# Altium schematic sheet usb_to_uart_swd_bridge.SchDoc: Bridge, USB to UART, SWD
size B; Organization: Altium Limited; Address1: L3, 12a Rodborough Rd; Address2: Frenchs Forest; Address3: NSW; Address4: Australia 2086; Revision: A; SheetNumber: 6; SheetTotal: 7
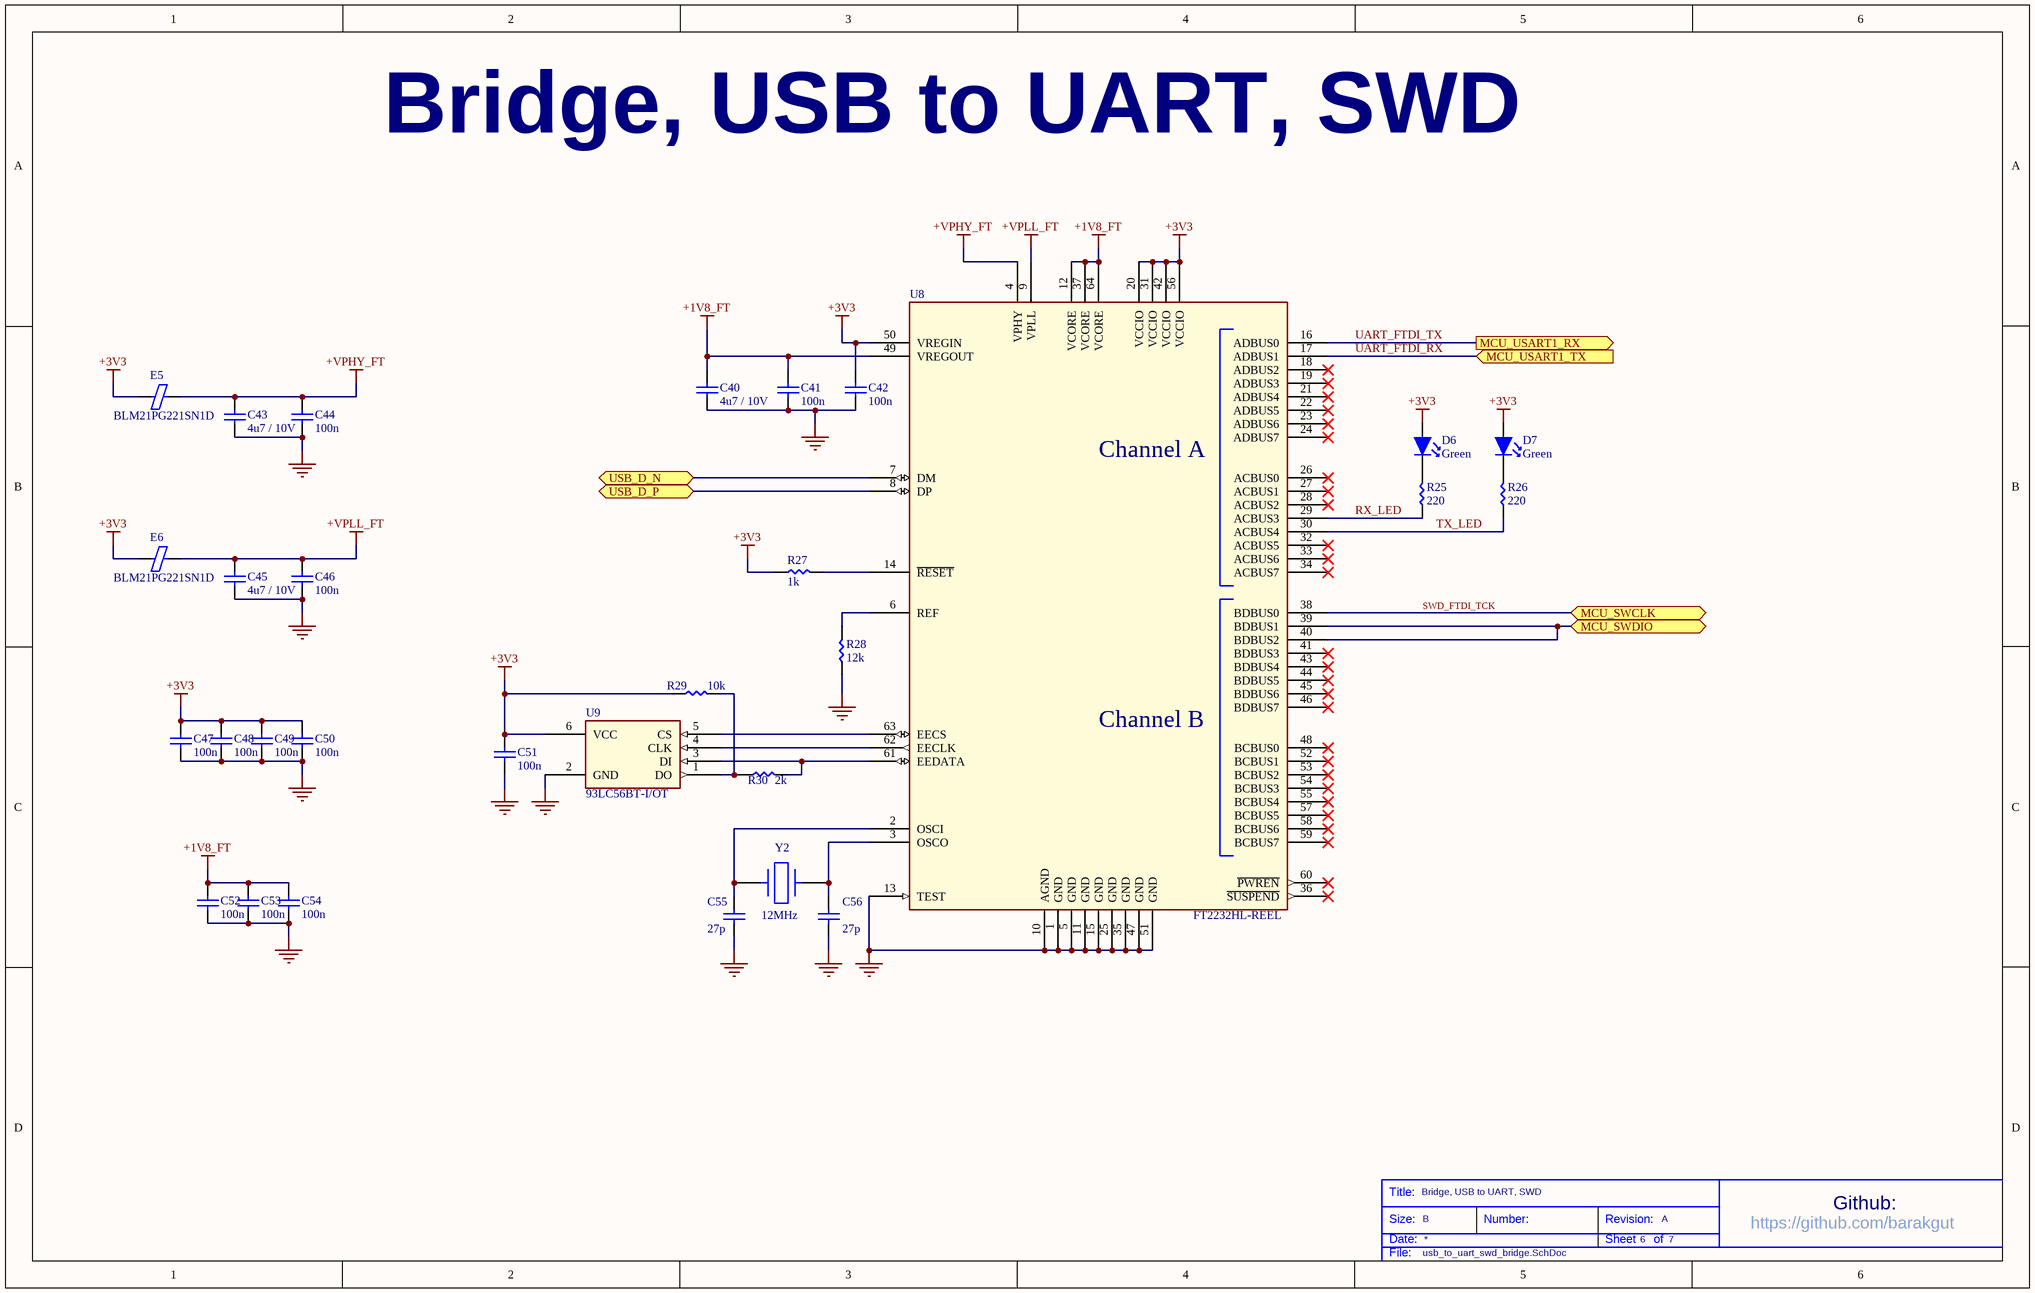
[diagram p0: usb_to_uart_swd_bridge.SchDoc]

## Parts
C40  4u7 / 10V  [C0805]
C41  100n  [C0402]
C42  100n  [C0402]
C43  4u7 / 10V  [C0805]
C44  100n  [C0402]
C45  4u7 / 10V  [C0805]
C46  100n  [C0402]
C47  100n  [C0402]
C48  100n  [C0402]
C49  100n  [C0402]
C50  100n  [C0402]
C51  100n  [C0402]
C52  100n  [C0402]
C53  100n  [C0402]
C54  100n  [C0402]
C55  27p  [C0402]
C56  27p  [C0402]
D6  Green  [150141VS73100_LED]
D7  Green  [150141VS73100_LED]
E5  BLM21PG221SN1D  [R0805]
E6  BLM21PG221SN1D  [R0805]
R25  220  [R0805]
R26  220  [R0805]
R27  1k  [R0805]
R28  12k  [R0805]
R29  10k  [R0805]
R30  2k  [R0805]
U8  FT2232HL-REEL  [LQFP64]
U9  93LC56BT-I/OT  [SOT-23-6]
Y2  12MHz  [ABLS7M2-12.000MHZ-D-2Y-T]

## Ports
MCU_SWCLK (bidir), MCU_SWDIO (bidir), MCU_USART1_RX (out), MCU_USART1_TX (in), USB_D_N (bidir), USB_D_P (bidir)

## Nets
+1V8_FT: C40.2 C41.2 C52.2 C53.2 C54.2 U8.12(VCORE) U8.37(VCORE) U8.49(VREGOUT) U8.64(VCORE)
+3V3: C42.2 C47.2 C48.2 C49.2 C50.2 C51.2 D6.2(A) D7.2(A) E5.1 E6.1 R27.1 R29.1 U8.20(VCCIO) U8.31(VCCIO) U8.42(VCCIO) U8.50(VREGIN) U8.56(VCCIO) U9.6(VCC)
+VPHY_FT: C43.2 C44.2 E5.2 U8.4(VPHY)
+VPLL_FT: C45.2 C46.2 E6.2 U8.9(VPLL)
GND: C40.1 C41.1 C42.1 C43.1 C44.1 C45.1 C46.1 C47.1 C48.1 C49.1 C50.1 C51.1 C52.1 C53.1 C54.1 C55.1 C56.1 R28.1 U8.1(GND) U8.5(GND) U8.10(AGND) U8.11(GND) U8.13(TEST) U8.15(GND) U8.25(GND) U8.35(GND) U8.47(GND) U8.51(GND) U9.2(GND)
MCU_SWDIO: U8.39(BDBUS1) U8.40(BDBUS2) ; port MCU_SWDIO
RX_LED: R25.1 U8.29(ACBUS3)
SWD_FTDI_TCK: U8.38(BDBUS0) ; port MCU_SWCLK
TX_LED: R26.1 U8.30(ACBUS4)
UART_FTDI_RX: U8.17(ADBUS1) ; port MCU_USART1_TX
UART_FTDI_TX: U8.16(ADBUS0) ; port MCU_USART1_RX
USB_D_N: U8.7(DM) ; port USB_D_N
USB_D_P: U8.8(DP) ; port USB_D_P
NetC55_2: C55.2 U8.2(OSCI) Y2.2
NetC56_2: C56.2 U8.3(OSCO) Y2.1
NetD6_1: D6.1(K) R25.2
NetD7_1: D7.1(K) R26.2
NetR27_2: R27.2 U8.14(~{RESET})
NetR28_2: R28.2 U8.6(REF)
NetR29_2: R29.2 R30.1 U9.1(DO)
NetR30_2: R30.2 U8.61(EEDATA) U9.3(DI)
NetU8_62: U8.62(EECLK) U9.4(CLK)
NetU8_63: U8.63(EECS) U9.5(CS)

Not connected (* = marked no-connect by the designer): U8 18(ADBUS2)* 19(ADBUS3)* 21(ADBUS4)* 22(ADBUS5)* 23(ADBUS6)* 24(ADBUS7)* 26(ACBUS0)* 27(ACBUS1)* 28(ACBUS2)* 32(ACBUS5)* 33(ACBUS6)* 34(ACBUS7)* 36(~{SUSPEND})* 41(BDBUS3)* 43(BDBUS4)* 44(BDBUS5)* 45(BDBUS6)* 46(BDBUS7)* 48(BCBUS0)* 52(BCBUS1)* 53(BCBUS2)* 54(BCBUS3)* 55(BCBUS4)* 57(BCBUS5)* 58(BCBUS6)* 59(BCBUS7)* 60(~{PWREN})*

## Notes on the sheet
- Bridge, USB to UART, SWD
- Title:
- Size:
- Date:
- B
- Number:
- Revision:
- Sheet
- of
- https://github.com/barakgut
- Github:
- File:
- (in symbol FT2232HL-REEL) Channel A; Channel B

## Library data of the parts
C40 C43 C45 = C2012X7R1A475K085AC: 4.7µF ±10% 10V X7R Ceramic Capacitor -55°C ~ 125°C Surface Mount, MLCC 0805 (2012 Metric) 0.079" L x 0.049" W (2.00mm x 1.25mm); Manufacturer: TDK; Product Training Modules: C Series General Applications SEAT, CCV, and TVCL Design Tools Guide to Replacing an Electrolytic Capacitor with an MLCC; EDA / CAD Models: Download from Accelerated Designs; Online Catalog: C Series, General Purpose; Other Names: 445-14527-6; Supplier 1: Digi-Key; Supplier Part Number 1: 445-14527-1-ND; Stock 1: 1; Pricing 1: 1=0.28, 10=0.19, 100=0.1075, 500=0.0759, 1000=0.0664 (USD); RoHS Information: RoHS Certificate-MLCC; Standard Package: 1; Category: Capacitors; Family: Ceramic Capacitors; Series: C; Packaging: Digi-Reel®; Capacitance: 4.7µF; Tolerance: ±10%; Voltage - Rated: 10V; Temperature Coefficient: X7R; Mounting Type: Surface Mount, MLCC; Operating Temperature: -55°C ~ 125°C; Applications: General Purpose; Package / Case: 0805 (2012 Metric); Size / Dimension: 0.079" L x 0.049" W (2.00mm x 1.25mm); Thickness (Max): 0.039" (1.00mm); Manufacturer Part Number: C2012X7R1A475K085AC
C41 C42 C44 C46-C54 = CGA2B3X7R1E104K050BB: TDK         CGA2B3X7R1E104K050BB             SMD Multilayer Ceramic Capacitor, 0402 [1005 Metric], 0.1 F, 25 V,  10%, X7R, CGA Series; PCN Part Number: MLCC Part Number Change 30/Nov/2012; Capacitance: 0.1µF; Product Training Modules: CGA Series for Automotive Applications SEAT, CCV, and TVCL Design Tools Guide to Replacing an Electrolytic Capacitor with an MLCC; Featured Product: CGA Series MLCC Capacitors; Voltage - Rated: 25V; Online Catalog: CGA Series, Automotive General, Mid and High Voltage; Other Names: 445-6902-6; Supplier 1: Digi-Key; Supplier Part Number 1: 445-6902-1-ND; Manufacturer: TDK; Stock 1: 100000; Pricing 1: 1=0.16, 10=0.115, 100=0.054, 500=0.0379, 1000=0.0314, 2500=0.0292, 5000=0.0267 (USD); Package / Case: 0402 (1005 Metric); Packaging: Digi-Reel®; RoHS Information: RoHS Certificate-MLCC; Standard Package: 1; Category: Capacitors; Family: Ceramic Capacitors; Series: CGA; Tolerance: ±10%; Temperature Coefficient: X7R; Mounting Type: Surface Mount, MLCC; Operating Temperature: -55°C ~ 125°C; Applications: Automotive; Ratings: AEC-Q200; Size / Dimension: 0.039" L x 0.020" W (1.00mm x 0.50mm); Height - Seated (Max): -; Thickness (Max): 0.022" (0.55mm); Lead Spacing: -; Features: -; Lead Style: -; ComponentLink1URL: http://www.farnell.com/datasheets/1735392.pdf; ComponentLink1Description: http://www.farnell.com/datasheets/1735392.pdf; ComponentLink2URL: http://www.mouser.com/ds/2/400/lcc_automotive_general_en-843974.pdf; ComponentLink2Description: http://www.mouser.com/ds/2/400/lcc_automotive_general_en-843974.pdf; Manufacturer Part Number: CGA2B3X7R1E104K050BB
C55 C56 = GJM1555C1H270FB01D: Manufacturer: Murata; Supplier 1: Digi-Key; Supplier Part Number 1: 490-16380-1-ND; Stock 1: 14501; Pricing 1: 1=0.23, 10=0.155, 100=0.0784, 500=0.0536, 1000=0.0474, 2500=0.0454, 5000=0.0413 (USD); Manufacturer Part Number: GJM1555C1H270FB01D; ComponentLink1URL: http://datasheet.octopart.com/GJM1555C1H270FB01D-Murata-datasheet-8819587.pdf; ComponentLink1Description: http://datasheet.octopart.com/GJM1555C1H270FB01D-Murata-datasheet-8819587.pdf; ComponentLink2URL: http://datasheet.octopart.com/GJM1555C1H270FB01D-Murata-datasheet-10025737.pdf; ComponentLink2Description: http://datasheet.octopart.com/GJM1555C1H270FB01D-Murata-datasheet-10025737.pdf; ComponentLink3URL: http://datasheet.octopart.com/GJM1555C1H270FB01D-Murata-datasheet-11978611.pdf; ComponentLink3Description: http://datasheet.octopart.com/GJM1555C1H270FB01D-Murata-datasheet-11978611.pdf; ComponentLink4URL: http://datasheet.octopart.com/GJM1555C1H270FB01D-Murata-datasheet-12510076.pdf; ComponentLink4Description: http://datasheet.octopart.com/GJM1555C1H270FB01D-Murata-datasheet-12510076.pdf; ComponentLink5URL: http://datasheet.octopart.com/GJM1555C1H270FB01D-Murata-datasheet-12515295.pdf; ComponentLink5Description: http://datasheet.octopart.com/GJM1555C1H270FB01D-Murata-datasheet-12515295.pdf
D6 D7 = 150141VS73100: WURTH ELEKTRONIK   150141VS73100   LED, GREEN, 90MCD, 570NM; Manufacturer: Wurth Electronics; Dynamic Catalog: 3.5mm x 2.8mm Round with Flat Top LEDs; 3D Model: SMTW_3528.igs / SMTW_3528.stp / SMTW_3528.wrl; Wavelength - Peak: 572nm; Voltage - Forward (Vf) (Typ): 2V; Current - Test: 20mA; Viewing Angle: 120°; Lens Type: Clear; Lens Style/Size: Round with Flat Top, 2.4mm; Other Names: 732-5002-1; Supplier 1: Digi-Key; Supplier Part Number 1: 732-5002-1-ND; Stock 1: 7722; Pricing 1: 1=0.17, 100=0.149, 500=0.113 (USD); Standard Package: 1; Category: Optoelectronics; Family: LED Indication - Discrete; Series: WL-SMTW; Packaging: Cut Tape (CT); Color: Green; Wavelength - Dominant: 570nm; Millicandela Rating: 90mcd; Package / Case: 2-PLCC; Size / Dimension: 3.20mm L x 2.80mm W; Height: 2.10mm; Mounting Type: Surface Mount; Online Catalog: 3.5mm x 2.8mm Round with Flat Top LEDs; Manufacturer Part Number: 150141VS73100
E5 E6 = BLM21PG221SN1D: FERRITE CHIP 220 OHM 0805; Manufacturer: Murata; Product Training Modules: Ferrite Beads and Arrays; Catalog Drawings: BLM21 Series Side BLM21 Series Top; EDA / CAD Models: Download from Accelerated Designs; Filter Type: Power Line; Number of Lines: 1; Impedance @ Frequency: 220 Ohm @ 100MHz; Current Rating (Max): 2A; DC Resistance (DCR) (Max): 45 mOhm; Online Catalog: EMIFIL® BLM21P Series; Other Names: 490-1054-6; Supplier 1: Digi-Key; Supplier Part Number 1: 490-1054-1-ND; Stock 1: 1796179; Pricing 1: 1=0.1, 10=0.081, 25=0.0732, 50=0.0538, 100=0.0464, 250=0.0366, 500=0.0309, 1000=0.0261 (USD); Standard Package: 1; Category: Filters; Family: Ferrite Beads and Chips; Series: BLM21P; Packaging: Digi-Reel®; Ratings: -; Operating Temperature: -55°C ~ 125°C; Package / Case: 0805 (2012 Metric); Mounting Type: Surface Mount; Height (Max): 0.041" (1.05mm); Size / Dimension: 0.079" L x 0.049" W (2.00mm x 1.25mm); Manufacturer Part Number: BLM21PG221SN1D
R25 R26 = AC0805FR-07220RL: Thick Film Resistors - SMD 1/8W 220ohm 1%; Manufacturer: Yageo; Case Height: 0.5 mm; Case Length: 2 mm; Case Width: 1.25 mm; Power Rating: 125 mW (1/8 W); Resistance: 220 Ohms; Temperature Coefficient: 100 PPM / C; Voltage Rating: 150 V; Supplier 1: Digi-Key; Supplier Part Number 1: YAG3711CT-ND; Stock 1: 11948; Pricing 1: 1=0.1, 10=0.055, 100=0.0225, 1000=0.0101, 2500=0.0088 (USD); Brand: Yageo; Case Code - in: 0805; Case Code - mm: 2012; Dimensions: 1.25 mm W x 2 mm L x 0.5 mm H; Product Category: Thick Film Resistors - SMD; Operating Temperature Range: - 55 C to + 155 C; Package / Case: 0805 (2012 metric); Packaging: Reel; Product: Thick Film Resistors SMD; Termination Style: SMD/SMT; RoHS: Details; Tolerance: 1 %; Series: AC; Type: Chip Resistor Surface Mount; Manufacturer Part Number: AC0805FR-07220RL
R27 = RC0805FR-071KL: RES SMD 1K OHM 1% 1/8W 0805; Manufacturer: Yageo; Resistance: 1 kOhms; Power Rating: 125 mW (1/8 W); Voltage Rating: 150 V; Temperature Coefficient: 100 PPM / C; Supplier 1: Digi-Key; Supplier Part Number 1: 311-1.00KCRCT-ND; Stock 1: 1262363; Pricing 1: 1=0.1, 10=0.046, 100=0.0186, 1000=0.0084, 2500=0.0073 (USD); Termination Style: SMD/SMT; Product: Thick Film Resistors General Purpose; Tolerance: 1 %; Case Code - in: 0805; Case Code - mm: 2012; Series: RC; Operating Temperature Range: - 55 C to + 155 C; Packaging: Reel; Manufacturer Part Number: RC0805FR-071KL
R28 = AC0805FR-0712KL: Res Thick Film 0805 12K Ohm 1% 0.125W(1/8W) ±100ppm/C Sulfur Resistant Molded SMD Automotive Paper T/R; Manufacturer: Yageo; Resistance: 12kohm; Temperature Coefficient: ±100; Product Length (mm): 2mm; Product Depth (mm): 1.25mm; Product Height (mm): 0.5mm; Supplier 1: Digi-Key; Supplier Part Number 1: YAG3692CT-ND; Stock 1: 218; Pricing 1: 1=0.1, 10=0.055, 100=0.0225, 1000=0.0101, 2500=0.0088 (USD); Type: Thick Film; Power Rating(s): 1/8W; Tolerance (+ or -): 1%; Package / Case: 0805; Packaging: Tape and Reel; Operating Temp Range: -55C to 155C; Case Style: Molded; Military Standard: Not Required; Failure Rate: Not Required; Construction: Rectangular; Termination Style: Not Required; Manufacturer Part Number: AC0805FR-0712KL
R29 = RC0805FR-0710KL: RES SMD 10K OHM 1% 1/8W 0805; Manufacturer: Yageo; Resistance: 10 kOhms; Power Rating: 125 mW (1/8 W); Voltage Rating: 150 V; Temperature Coefficient: 100 PPM / C; Supplier 1: Digi-Key; Supplier Part Number 1: 311-10.0KCRCT-ND; Stock 1: 31531286; Pricing 1: 1=0.1, 10=0.046, 100=0.0186, 1000=0.0084, 2500=0.0073 (USD); Termination Style: SMD/SMT; Product: Thick Film Resistors General Purpose; Tolerance: 1 %; Case Code - in: 0805; Case Code - mm: 2012; Series: RC; Operating Temperature Range: - 55 C to + 155 C; Packaging: Reel; Manufacturer Part Number: RC0805FR-0710KL
R30 = RC0805FR-072KL: RES SMD 2K OHM 1% 1/8W 0805; Manufacturer: Yageo; Resistance: 2 kOhms; Power Rating: 125 mW (1/8 W); Voltage Rating: 150 V; Temperature Coefficient: 100 PPM / C; Supplier 1: Digi-Key; Supplier Part Number 1: 311-2.00KCRCT-ND; Stock 1: 993055; Pricing 1: 1=0.1, 10=0.046, 100=0.0186, 1000=0.0084, 2500=0.0073 (USD); Termination Style: SMD/SMT; Product: Thick Film Resistors General Purpose; Tolerance: 1 %; Case Code - in: 0805; Case Code - mm: 2012; Series: RC; Operating Temperature Range: - 55 C to + 155 C; Packaging: Reel; Manufacturer Part Number: RC0805FR-072KL
U8 = FT2232HL-REEL: IC USB HS DUAL UART/FIFO 64-LQFP; Manufacturer: FTDI; Number of Channels: 2; Interface Circuit Standard 1: RS-232/RS-422/RS-485; Transmitter and Receiver FIFO Counter: No; Data Rate: 480Mbps; Operating Supply Voltage (Typ): 1.8/3.3V; Operating Supply Voltage (Max): 3.63V; Operating Supply Voltage (Min): 1.62V; Supply Current: 70(Typ)mA; Supplier 1: Digi-Key; Supplier Part Number 1: 768-1024-1-ND; Stock 1: 30383; Pricing 1: 1=6.71, 10=6.2, 100=5.4, 250=4.56, 500=4.06 (USD); Package Type: LQFP; Packaging: Tape and Reel; Mounting: Surface Mount; Pin Count: 64; Operating Temperature (Min): -40C; Operating Temperature (Max): 85C; Operating Temperature Classification: Industrial; Manufacturer Part Number: FT2232HL-REEL
U9 = 93LC56BT-I/OT: EEPROM 128x16; Manufacturer: Microchip; Access Time (Max): 250 ns; Data Retention: 200; Density: 2048 Bit; Frequency: 2 MHz; Interface Type: Serial (Microwire); Operating Supply Voltage (Max): 5.5 V; Operating Supply Voltage (Min): 2.5 V; Operating Supply Voltage (Typ): 3.3/5 V; Programmable: Yes; Rad Hardened: No; Supply Current: 2 mA; Supplier 1: Digi-Key; Supplier Part Number 1: 93LC56BT-I/OTCT-ND; Stock 1: 24330; Pricing 1: 1=0.23, 25=0.2164, 100=0.2119 (USD); Mounting: Surface Mount; Operating Temp Range: -40C to 85C; Operating Temperature (Max): 85C; Operating Temperature (Min): -40C; Operating Temperature Classification: Industrial; Organization: 128x16; Package Type: SOT-23; Packaging: Tape and Reel; Pin Count: 6; Write Protection: No; Manufacturer Part Number: 93LC56BT-I/OT
Y2 = ABLS7M2-12.000MHZ-D-2Y-T: Crystals 12.0MHz 18pF 30ppm -40C +85C; Manufacturer: Abracon; Frequency Tolerance: ±20ppm; ESR (Equivalent Series Resistance): 60 Ohm; Operating Mode: Fundamental; Supplier 1: Digi-Key; Supplier Part Number 1: 535-12824-1-ND; Stock 1: 6192; Pricing 1: 1=0.4, 10=0.33, 50=0.297, 100=0.264, 500=0.2508, 1000=0.2112 (USD); Category: Crystals and Oscillators; Family: Crystals; Series: ABLS7M2; Packaging: Tape & Reel (TR); Type: MHz Crystal; Frequency: 12MHz; Frequency Stability: ±30ppm; Load Capacitance: 18pF; Operating Temperature: -40°C ~ 85°C; Ratings: -; Mounting Type: Surface Mount; Package / Case: 2-SMD, Flat Lead; Size / Dimension: 0.276" L x 0.161" W (7.00mm x 4.10mm); Height: 0.079" (2.00mm); Manufacturer Part Number: ABLS7M2-12.000MHZ-D-2Y-T